# Altium project Power_Management_System.PrjPCB
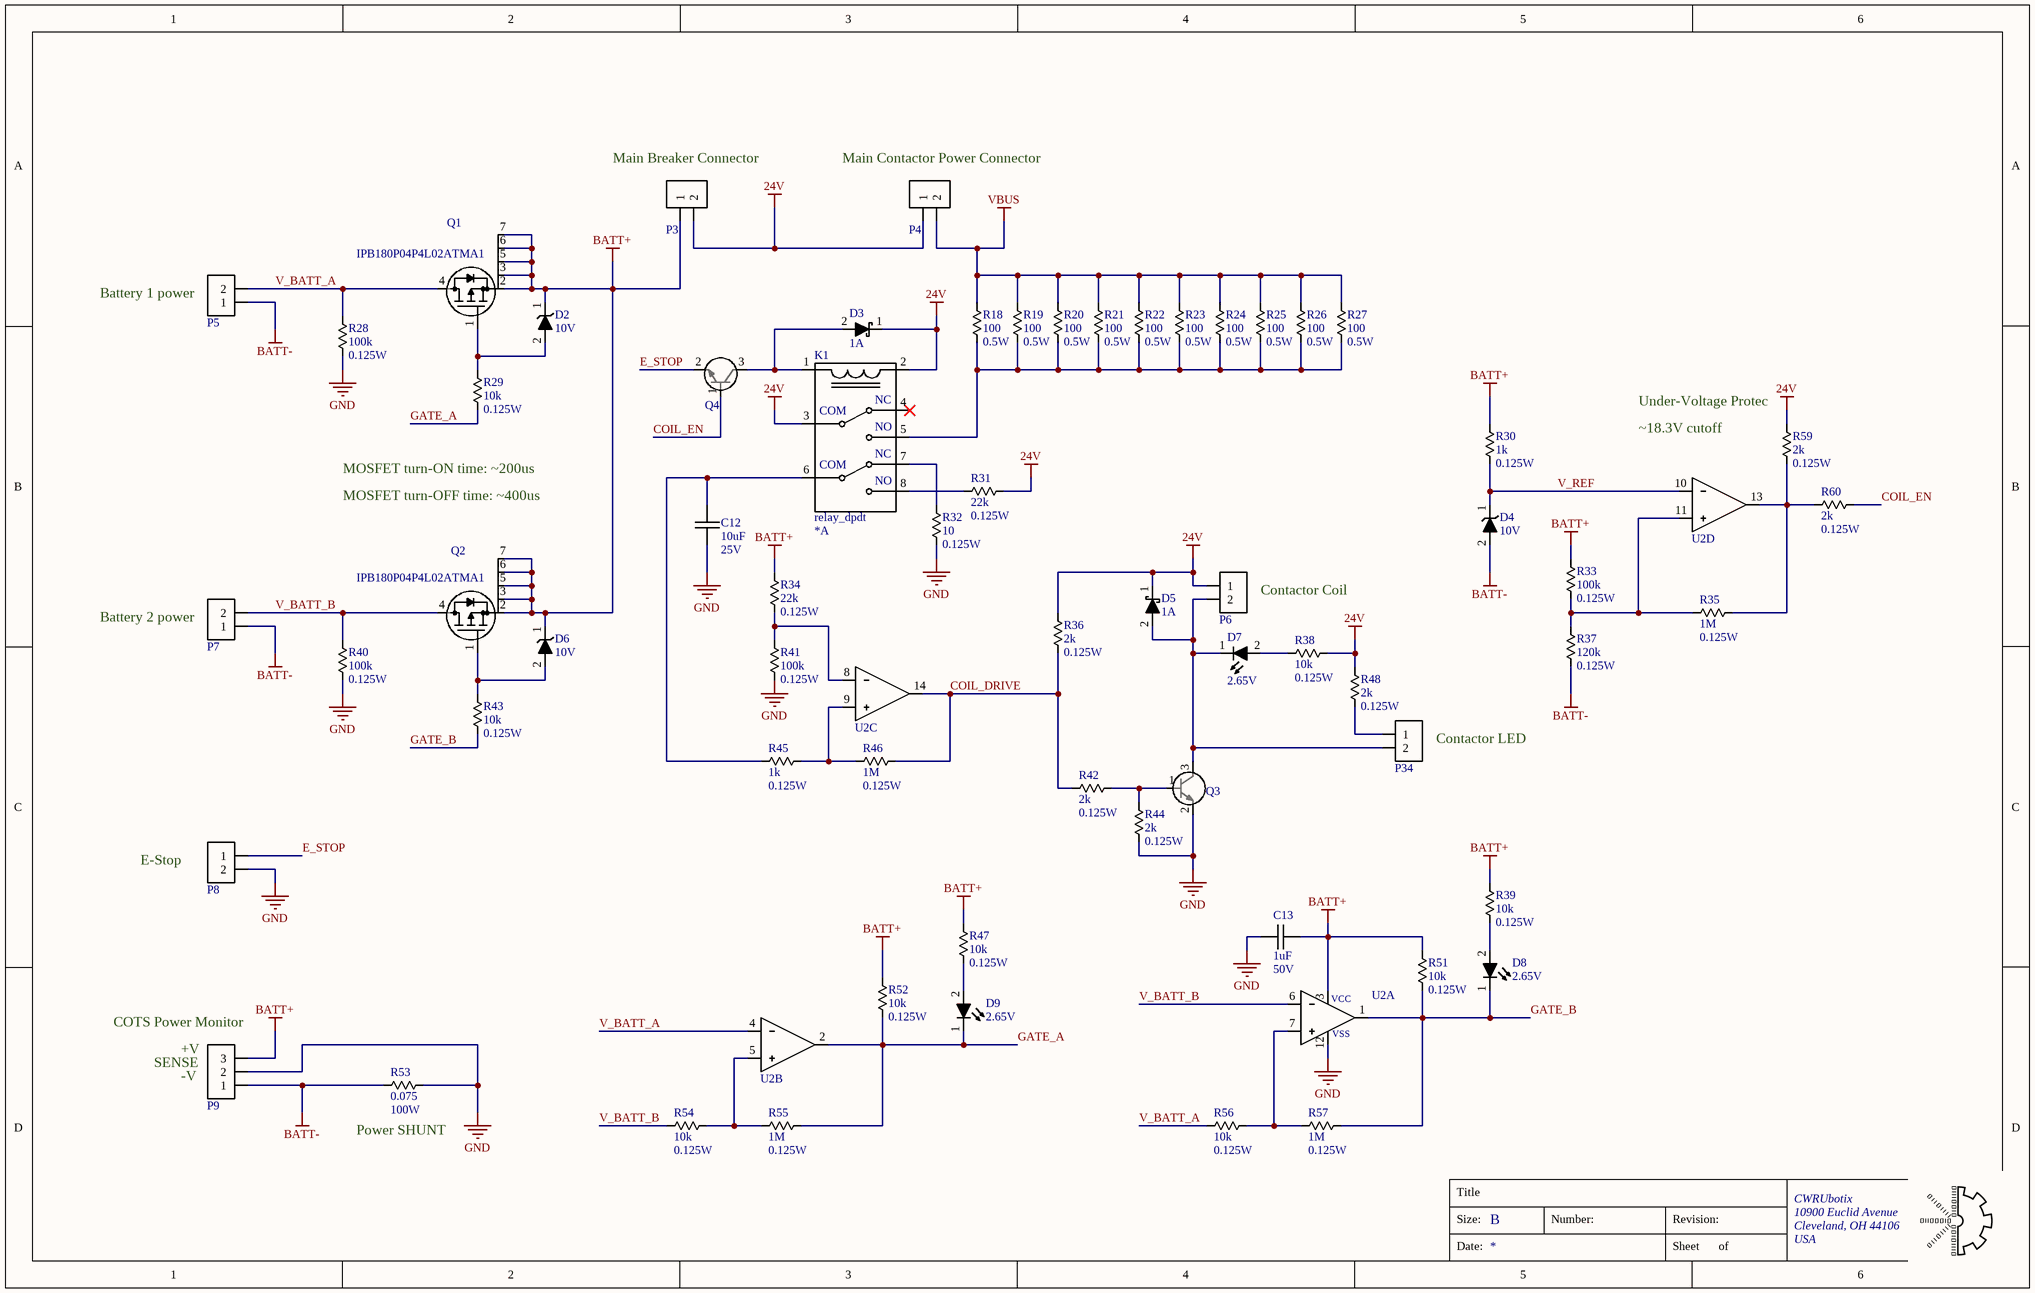
[diagram p0: power_input_SCH1.SchDoc]
3 sheets, 128 parts. Net scope: global (net labels, ports and power ports of the same name join across sheets).
Board file: PMS_board.PcbDoc
Sheets:
  power_input_SCH1.SchDoc
  battery_manager_SCH2.SchDoc
  power_output_SCH3.SchDoc

## Sheet power_input_SCH1.SchDoc
size B; Organization: CWRUbotix; Address1: 10900 Euclid Avenue; Address2: Cleveland, OH 44106; Address3: USA

### Parts
C12  Capacitance: 10uF  Voltage Rating: 25V  [chip_1206]  (hidden comment: cap_single_np)
C13  Capacitance: 1uF  Voltage Rating: 50V  [chip_0805]  (hidden comment: cap_single_np)
D2  Reverse Breakdown Voltage: 10V  [sod323_0]  (hidden comment: diode_1)
D3  Current Rating: 1A  [sod123_0]  (hidden comment: diode_2)
D4  Reverse Breakdown Voltage: 10V  [sod323_0]  (hidden comment: diode_1)
D5  Current Rating: 1A  [sod123_0]  (hidden comment: diode_2)
D6  Reverse Breakdown Voltage: 10V  [sod323_0]  (hidden comment: diode_1)
D7  Forward Voltage: 2.65V  [chip_0603]  (hidden comment: diode_4)
D8  Forward Voltage: 2.65V  [chip_0603]  (hidden comment: diode_4)
D9  Forward Voltage: 2.65V  [chip_0603]  (hidden comment: diode_4)
K1  relay_dpdt  Contact Current Rating: *A  [RELAY_SHRACK_RT2]
P3  conn-2x1_0  [BARR_0.5IN_2x1_0]  (value not drawn)
P4  conn-2x1_0  [BARR_0.5IN_2x1_0]  (value not drawn)
P5  conn-2x1_0  [BARR_0.5IN_2x1_0]  (value not drawn)
P6  conn-2x1_0  [JST_PHR_2_0]  (value not drawn)
P7  conn-2x1_0  [BARR_0.5IN_2x1_0]  (value not drawn)
P8  conn-2x1_0  [JST_PHR_2_0]  (value not drawn)
P9  conn-3x1_0  [JST_PHR_3_0]  (value not drawn)
P34  conn-2x1_0  [JST_PHR_2_0]  (value not drawn)
Q1  Manufacturer PN: IPB180P04P4L02ATMA1  [PG-TO263-7-3]  (hidden comment: p-mosfet_4)
Q2  Manufacturer PN: IPB180P04P4L02ATMA1  [PG-TO263-7-3]  (hidden comment: p-mosfet_4)
Q3  npn-bjt_0  [sot-23-3]  (value not drawn)
Q4  npn-bjt_0  [sot-23-3]  (value not drawn)
R18  Resistance: 100  Power Rating: 0.5W  [chip_1206]  (hidden comment: res_single)
R19  Resistance: 100  Power Rating: 0.5W  [chip_1206]  (hidden comment: res_single)
R20  Resistance: 100  Power Rating: 0.5W  [chip_1206]  (hidden comment: res_single)
R21  Resistance: 100  Power Rating: 0.5W  [chip_1206]  (hidden comment: res_single)
R22  Resistance: 100  Power Rating: 0.5W  [chip_1206]  (hidden comment: res_single)
R23  Resistance: 100  Power Rating: 0.5W  [chip_1206]  (hidden comment: res_single)
R24  Resistance: 100  Power Rating: 0.5W  [chip_1206]  (hidden comment: res_single)
R25  Resistance: 100  Power Rating: 0.5W  [chip_1206]  (hidden comment: res_single)
R26  Resistance: 100  Power Rating: 0.5W  [chip_1206]  (hidden comment: res_single)
R27  Resistance: 100  Power Rating: 0.5W  [chip_1206]  (hidden comment: res_single)
R28  Resistance: 100k  Power Rating: 0.125W  [chip_0805]  (hidden comment: res_single)
R29  Resistance: 10k  Power Rating: 0.125W  [chip_0805]  (hidden comment: res_single)
R30  Resistance: 1k  Power Rating: 0.125W  [chip_0805]  (hidden comment: res_single)
R31  Resistance: 22k  Power Rating: 0.125W  [chip_0805]  (hidden comment: res_single)
R32  Resistance: 10  Power Rating: 0.125W  [chip_0805]  (hidden comment: res_single)
R33  Resistance: 100k  Power Rating: 0.125W  [chip_0805]  (hidden comment: res_single)
R34  Resistance: 22k  Power Rating: 0.125W  [chip_0805]  (hidden comment: res_single)
R35  Resistance: 1M  Power Rating: 0.125W  [chip_0805]  (hidden comment: res_single)
R36  Resistance: 2k  Power Rating: 0.125W  [chip_0805]  (hidden comment: res_single)
R37  Resistance: 120k  Power Rating: 0.125W  [chip_0805]  (hidden comment: res_single)
R38  Resistance: 10k  Power Rating: 0.125W  [chip_0805]  (hidden comment: res_single)
R39  Resistance: 10k  Power Rating: 0.125W  [chip_0805]  (hidden comment: res_single)
R40  Resistance: 100k  Power Rating: 0.125W  [chip_0805]  (hidden comment: res_single)
R41  Resistance: 100k  Power Rating: 0.125W  [chip_0805]  (hidden comment: res_single)
R42  Resistance: 2k  Power Rating: 0.125W  [chip_0805]  (hidden comment: res_single)
R43  Resistance: 10k  Power Rating: 0.125W  [chip_0805]  (hidden comment: res_single)
R44  Resistance: 2k  Power Rating: 0.125W  [chip_0805]  (hidden comment: res_single)
R45  Resistance: 1k  Power Rating: 0.125W  [chip_0805]  (hidden comment: res_single)
R46  Resistance: 1M  Power Rating: 0.125W  [chip_0805]  (hidden comment: res_single)
R47  Resistance: 10k  Power Rating: 0.125W  [chip_0805]  (hidden comment: res_single)
R48  Resistance: 2k  Power Rating: 0.125W  [chip_0805]  (hidden comment: res_single)
R51  Resistance: 10k  Power Rating: 0.125W  [chip_0805]  (hidden comment: res_single)
R52  Resistance: 10k  Power Rating: 0.125W  [chip_0805]  (hidden comment: res_single)
R53  Resistance: 0.075  Power Rating: 100W  [TO-247-2-H]  (hidden comment: res_single)
R54  Resistance: 10k  Power Rating: 0.125W  [chip_0805]  (hidden comment: res_single)
R55  Resistance: 1M  Power Rating: 0.125W  [chip_0805]  (hidden comment: res_single)
R56  Resistance: 10k  Power Rating: 0.125W  [chip_0805]  (hidden comment: res_single)
R57  Resistance: 1M  Power Rating: 0.125W  [chip_0805]  (hidden comment: res_single)
R59  Resistance: 2k  Power Rating: 0.125W  [chip_0805]  (hidden comment: res_single)
R60  Resistance: 2k  Power Rating: 0.125W  [chip_0805]  (hidden comment: res_single)
U2  LM339  [so-14]  (value not drawn)  (parts A,B,C,D of 4)

### Nets
24V: D3.1 D5.1 K1.2 K1.3(COM) P3.2 P4.1 P6.1 R31.2 R36.2 R38.2 R48.2 R59.2
BATT+: C13.2 D2.1 D6.1 P3.1 P9.3 Q1.2(S) Q1.3(S) Q1.5(S) Q1.6(S) Q1.7(S) Q2.2(S) Q2.3(S) Q2.5(S) Q2.6(S) Q2.7(S) R30.2 R33.1 R34.1 R39.1 R47.2 R51.1 R52.1 U2.3
BATT-: D4.2 P5.1 P7.1 P9.1 R37.2 R53.1
GND: C12.2 C13.1 P8.2 P9.2 Q3.2(E) R28.1 R32.2 R40.2 R41.2 R44.2 R53.2 U2.12
VBUS: P4.2 R18.2 R19.2 R20.2 R21.2 R22.2 R23.2 R24.2 R25.2 R26.2 R27.2
COIL_DRIVE: R36.1 R42.1 R46.2 U2.14
COIL_EN: Q4.1(B) R60.1
E_STOP: P8.1 Q4.2(E)
GATE_A: D9.1 R29.2 R52.2 R55.2 U2.2
GATE_B: D8.1 R43.2 R51.2 R57.2 U2.1
V_BATT_A: P5.2 Q1.4(D) R28.2 R56.1 U2.4
V_BATT_B: P7.2 Q2.4(D) R40.1 R54.1 U2.6
V_REF: D4.1 R30.1 U2.10
NetC12_1: C12.1 K1.6(COM) R45.1
NetD2_2: D2.2 Q1.1(G) R29.1
NetD3_2: D3.2 K1.1 Q4.3(C)
NetD5_2: D5.2 D7.1 P6.2 P34.2 Q3.3(C)
NetD6_2: D6.2 Q2.1(G) R43.1
NetD7_2: D7.2 R38.1
NetD8_2: D8.2 R39.2
NetD9_2: D9.2 R47.1
NetK1_5: K1.5(NO) R18.1 R19.1 R20.1 R21.1 R22.1 R23.1 R24.1 R25.1 R26.1 R27.1
NetK1_7: K1.7(NC) R32.1
NetK1_8: K1.8(NO) R31.1
NetP34_1: P34.1 R48.1
NetQ3_1: Q3.1(B) R42.2 R44.1
NetR33_2: R33.2 R35.1 R37.1 U2.11
NetR34_2: R34.2 R41.1 U2.8
NetR35_2: R35.2 R59.1 R60.2 U2.13
NetR45_2: R45.2 R46.1 U2.9
NetR54_2: R54.2 R55.1 U2.5
NetR56_2: R56.2 R57.1 U2.7

Not connected (* = marked no-connect by the designer): K1 4(NC)*

### Notes on the sheet
- (near P3) Main Breaker Connector
- (near P4) Main Contactor Power Connector
- (near P5) Battery 1 power
- (near R59) Under-Voltage Protec
- ~18.3V cutoff
- MOSFET turn-ON time: ~200us
- MOSFET turn-OFF time: ~400us
- (near P7) Battery 2 power
- Contactor Coil
- (near P34) Contactor LED
- (near P8) E-Stop
- (near P9) COTS Power Monitor
- (near P9) SENSE
- (near P9) +V
- (near P9) -V
- (near R53) Power SHUNT
- Title
- Size:
- B
- Number:
- Revision:
- Date:
- Sheet
- of
- (in symbol ANLG-00006, part A) VCC; VSS

### Library data of the parts
C12 = CAP-00539: CAP, 10uF, ±10%, 25V, X7R, 1206; Manufacturer: Samsung; Manufacturer PN: CL31B106KAHNNNE; Tolerance: ±10%; Part Number: CAP-00539; Type: X7R
C13 = CAP-00109: CAP, 1uF, 10%, 50V, X7R, 0805; Manufacturer: Murata; Manufacturer PN: GRM21BR71H105KA12L; Tolerance: 10%; Part Number: CAP-00109; Type: X7R
D2 D4 D6 = DIO-00019: Dio Zen, 10V, 2%, 200mW, SOD-323; Manufacturer: ON Semi; Manufacturer PN: MM3Z10VST1G; Forward Voltage: 900mV; Type: Zener; Part Number: DIO-00019; Tolerance: 2%; Power Rating: 200mW
D3 D5 = DIO-00001: Dio Shtky, 1A, 0.55V, 40V, SOD-123; Manufacturer: ON Semi; Manufacturer PN: MBR140SFT1G; Forward Voltage: 550mV; Type: Schottky; Reverse Breakdown Voltage: 40V; Part Number: DIO-00001
D7-D9 = DIO-00050: LED, Green, 0603, Low current, HELI2 Series; Manufacturer: Kingbright; Manufacturer PN: APT1608LZGCK; Reverse Breakdown Voltage: 5V; Current Rating: 30mA; Power Rating: 120mW; Type: LED; Part Number: DIO-00050; Cost: 0.58
K1 = MISC-00005: Relay 24V, 8A, DPDT; Manufacturer: TE Connectivity; Manufacturer PN: RTE24024; Latching: *; Turn-on Voltage: *; Turn-off Voltage: *; Part Number: MISC-00005; Cost: 3.12; Weight: 13
P3-P5 P7 = CONN-00001: Barrier Blk, 2 Pos, 50 A; Manufacturer: Molex; Manufacturer PN: 389690002; Positions per level: 2; Levels: 1; Current: 50; Part Number: CONN-00001; Type: Barrier Block; Cost: 1.68; Weight: 7.5
P6 P8 P34 = CONN-00048: JST PH 2x1, THT, 2.00mm Pitch; Manufacturer PN: B2B-PH-K; Positions per level: 2; Levels: 1; Part Number: CONN-00048; Type: Header; Manufacturer: JST; Cost: 0.19
P9 = CONN-00047: JST PH 3x1, THT, 2.00mm Pitch; Manufacturer PN: B3B-PH-K; Positions per level: 3; Levels: 1; Part Number: CONN-00047; Type: Header; Manufacturer: JST; Cost: 0.19
Q1 Q2 = XSTR-00027: XSTR PFET, 180A, 40V, Vgs 1.7V, PG-TO263-7-3; Manufacturer: Infineon; Max Power: 150W; Max Current: 180A; Max Voltage: 40V; Type: PFET; Part Number: XSTR-00027; Vgs/Vce: 1.7V; Cost: 2.99
Q3 Q4 = XSTR-00021: XSTR NPN, 2A, 100V, Vce 0.15V, SOT-23; Manufacturer: ON Semi; Manufacturer PN: NSS1C201LT1G; Max Power: 490mW; Max Current: 2A; Max Voltage: 100V; Type: NPN; Part Number: XSTR-00021; Vgs/Vce: 0.15V; Cost: 0.48
R18-R27 = RES-00595: RES SMD 100 OHM 1% 1/2W 1206; Tolerance: 1%; Part Number: RES-00595
R28 R33 R40 R41 = RES-00302: RES SMD 100K OHM 1% 1/8W 0805; Manufacturer: Rohm Semiconductor; Manufacturer PN: KTR10EZPF1003; Tolerance: 1%; Part Number: RES-00302
R29 R38 R39 R43 R47 R51 R52 R54 R56 = RES-00307: RES SMD 10K OHM 1% 1/8W 0805; Manufacturer: Rohm Semiconductor; Manufacturer PN: KTR10EZPF1002; Tolerance: 1%; Part Number: RES-00307
R30 R45 = RES-00361: RES SMD 1K OHM 1% 1/8W 0805; Manufacturer: Rohm Semiconductor; Manufacturer PN: KTR10EZPF1001; Tolerance: 1%; Part Number: RES-00361
R31 R34 = RES-00391: RES SMD 22K OHM 1% 1/8W 0805; Manufacturer: Rohm Semiconductor; Manufacturer PN: KTR10EZPF2202; Tolerance: 1%; Part Number: RES-00391
R32 = RES-00117: RES SMD 10 OHM 1% 1/8W 0805; Manufacturer: Rohm Semiconductor; Manufacturer PN: KTR10EZPF10R0; Tolerance: 1%; Part Number: RES-00117
R35 R46 R55 R57 = RES-00363: RES SMD 1M OHM 1% 1/8W 0805; Manufacturer: Rohm Semiconductor; Manufacturer PN: KTR10EZPF1004; Tolerance: 1%; Part Number: RES-00363
R36 R42 R44 R48 R59 R60 = RES-00414: RES SMD 2K OHM 1% 1/8W 0805; Manufacturer: Rohm Semiconductor; Manufacturer PN: KTR10EZPF2001; Tolerance: 1%; Part Number: RES-00414
R37 = RES-00319: RES SMD 120K OHM 1% 1/8W 0805; Manufacturer: Rohm Semiconductor; Manufacturer PN: KTR10EZPF1203; Tolerance: 1%; Part Number: RES-00319
R53 = RES-00688: RES THT 0.075 OHM 1% 100W TO-247-2 Board Mounted; Manufacturer: Caddock; Manufacturer PN: MP9100-0.075-1%; Tolerance: 1%; Part Number: RES-00688
U2 = ANLG-00006: Comp, Quad, LM339; Manufacturer: TI; Part Number: ANLG-00006; Manufacturer PN: LM339

## Sheet battery_manager_SCH2.SchDoc
size B; Organization: CWRUbotix; Address1: 10900 Euclid Avenue; Address2: Cleveland, OH 44106; Address3: USA
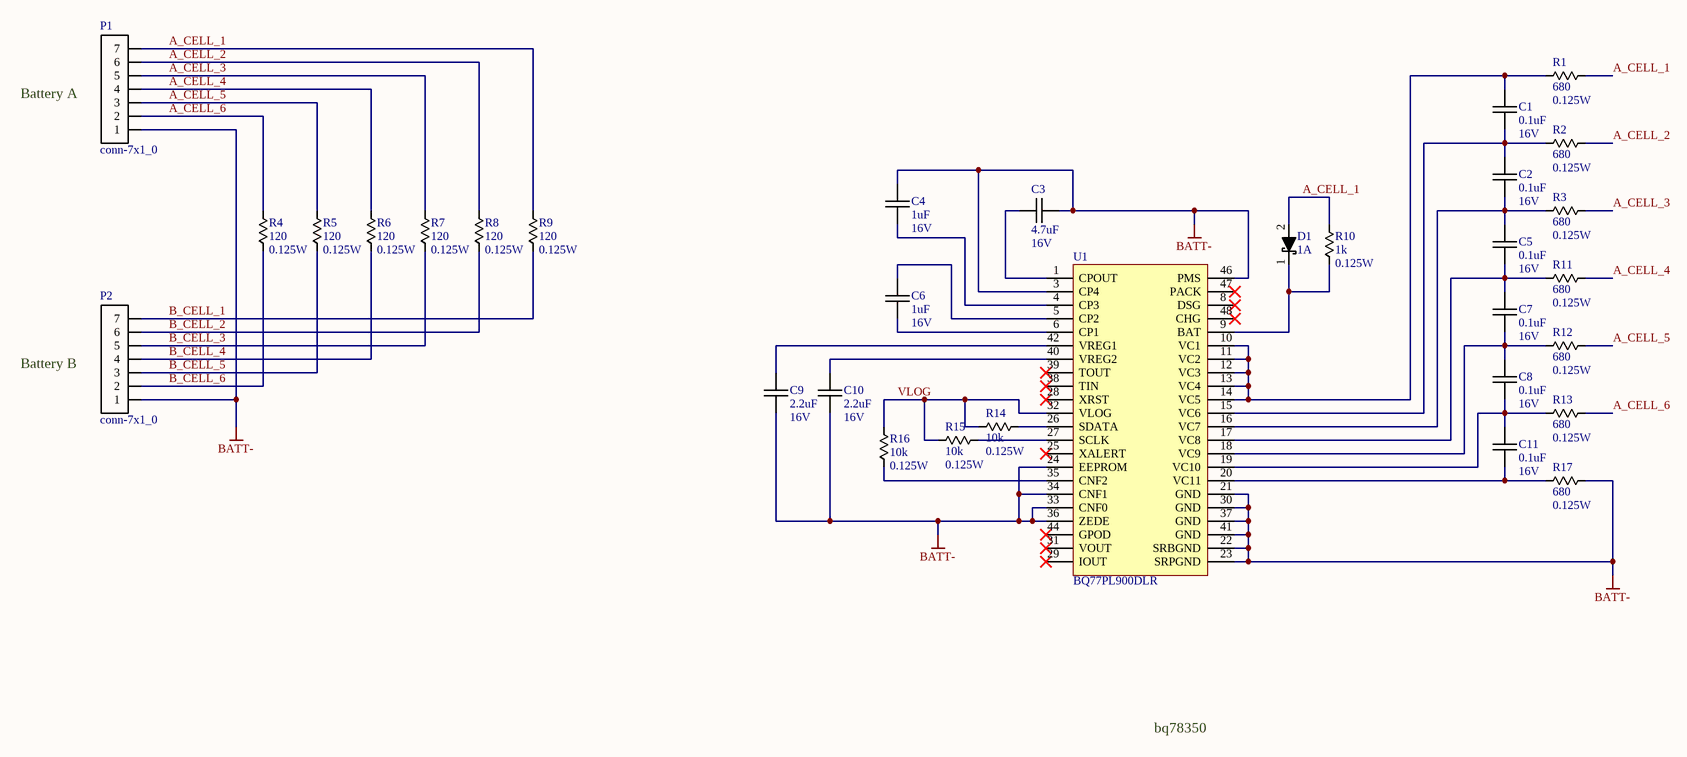
[diagram p1: battery_manager_SCH2.SchDoc]

### Parts
C1  Capacitance: 0.1uF  Voltage Rating: 16V  [chip_0603]  (hidden comment: cap_single_np)
C2  Capacitance: 0.1uF  Voltage Rating: 16V  [chip_0603]  (hidden comment: cap_single_np)
C3  Capacitance: 4.7uF  Voltage Rating: 16V  [chip_0805]  (hidden comment: cap_single_np)
C4  Capacitance: 1uF  Voltage Rating: 16V  [chip_0805]  (hidden comment: cap_single_np)
C5  Capacitance: 0.1uF  Voltage Rating: 16V  [chip_0603]  (hidden comment: cap_single_np)
C6  Capacitance: 1uF  Voltage Rating: 16V  [chip_0805]  (hidden comment: cap_single_np)
C7  Capacitance: 0.1uF  Voltage Rating: 16V  [chip_0603]  (hidden comment: cap_single_np)
C8  Capacitance: 0.1uF  Voltage Rating: 16V  [chip_0603]  (hidden comment: cap_single_np)
C9  Capacitance: 2.2uF  Voltage Rating: 16V  [chip_0805]  (hidden comment: cap_single_np)
C10  Capacitance: 2.2uF  Voltage Rating: 16V  [chip_0805]  (hidden comment: cap_single_np)
C11  Capacitance: 0.1uF  Voltage Rating: 16V  [chip_0603]  (hidden comment: cap_single_np)
D1  Current Rating: 1A  [sod123_0]  (hidden comment: diode_2)
P1  conn-7x1_0  [JST_XH_7_0]
P2  conn-7x1_0  [JST_XH_7_0]
R1  Resistance: 680  Power Rating: 0.125W  [chip_0805]  (hidden comment: res_single)
R2  Resistance: 680  Power Rating: 0.125W  [chip_0805]  (hidden comment: res_single)
R3  Resistance: 680  Power Rating: 0.125W  [chip_0805]  (hidden comment: res_single)
R4  Resistance: 120  Power Rating: 0.125W  [chip_0805]  (hidden comment: res_single)
R5  Resistance: 120  Power Rating: 0.125W  [chip_0805]  (hidden comment: res_single)
R6  Resistance: 120  Power Rating: 0.125W  [chip_0805]  (hidden comment: res_single)
R7  Resistance: 120  Power Rating: 0.125W  [chip_0805]  (hidden comment: res_single)
R8  Resistance: 120  Power Rating: 0.125W  [chip_0805]  (hidden comment: res_single)
R9  Resistance: 120  Power Rating: 0.125W  [chip_0805]  (hidden comment: res_single)
R10  Resistance: 1k  Power Rating: 0.125W  [chip_0805]  (hidden comment: res_single)
R11  Resistance: 680  Power Rating: 0.125W  [chip_0805]  (hidden comment: res_single)
R12  Resistance: 680  Power Rating: 0.125W  [chip_0805]  (hidden comment: res_single)
R13  Resistance: 680  Power Rating: 0.125W  [chip_0805]  (hidden comment: res_single)
R14  Resistance: 10k  Power Rating: 0.125W  [chip_0805]  (hidden comment: res_single)
R15  Resistance: 10k  Power Rating: 0.125W  [chip_0805]  (hidden comment: res_single)
R16  Resistance: 10k  Power Rating: 0.125W  [chip_0805]  (hidden comment: res_single)
R17  Resistance: 680  Power Rating: 0.125W  [chip_0805]  (hidden comment: res_single)
U1  Manufacturer PN: BQ77PL900DLR  [SSOP-48_0]  (hidden comment: BQ77PL900)

### Nets
BATT-: C3.2 C4.1 C9.2 C10.2 P1.1 P2.1 R17.2 U1.3(CP4) U1.21(GND) U1.22(SRBGND) U1.23(SRPGND) U1.24(EEPROM) U1.30(GND) U1.33(CNF0) U1.34(CNF1) U1.36(ZEDE) U1.37(GND) U1.41(GND) U1.46(PMS)
A_CELL_1: D1.2 P1.7 R1.2 R9.1 R10.2
A_CELL_2: P1.6 R2.2 R8.1
A_CELL_3: P1.5 R3.2 R7.1
A_CELL_4: P1.4 R6.1 R11.2
A_CELL_5: P1.3 R5.1 R12.2
A_CELL_6: P1.2 R4.1 R13.2
B_CELL_1: P2.7 R9.2
B_CELL_2: P2.6 R8.2
B_CELL_3: P2.5 R7.2
B_CELL_4: P2.4 R6.2
B_CELL_5: P2.3 R5.2
B_CELL_6: P2.2 R4.2
VLOG: R14.1 R15.1 R16.2 U1.32(VLOG)
NetC1_1: C1.1 R1.1 U1.10(VC1) U1.11(VC2) U1.12(VC3) U1.13(VC4) U1.14(VC5)
NetC1_2: C1.2 C2.1 R2.1 U1.15(VC6)
NetC2_2: C2.2 C5.1 R3.1 U1.16(VC7)
NetC3_1: C3.1 U1.1(CPOUT)
NetC4_2: C4.2 U1.4(CP3)
NetC5_2: C5.2 C7.1 R11.1 U1.17(VC8)
NetC6_1: C6.1 U1.5(CP2)
NetC6_2: C6.2 U1.6(CP1)
NetC7_2: C7.2 C8.1 R12.1 U1.18(VC9)
NetC8_2: C8.2 C11.1 R13.1 U1.19(VC10)
NetC9_1: C9.1 U1.42(VREG1)
NetC10_1: C10.1 U1.40(VREG2)
NetC11_2: C11.2 R17.1 U1.20(VC11)
NetD1_1: D1.1 R10.1 U1.9(BAT)
NetR14_2: R14.2 U1.26(SDATA)
NetR15_2: R15.2 U1.27(SCLK)
NetR16_1: R16.1 U1.35(CNF2)

Not connected (* = marked no-connect by the designer): U1 2(NC) 7(NC) 8(DSG)* 25(XALERT)* 28(XRST)* 29(IOUT)* 31(VOUT)* 38(TIN)* 39(TOUT)* 43(NC) 44(GPOD)* 45(NC) 47(PACK)* 48(CHG)*

### Notes on the sheet
- (near P1) Battery A
- (near P2) Battery B
- bq78350
- Title
- Size:
- B
- Number:
- Revision:
- Date:
- Sheet
- of

### Library data of the parts
C1 C2 C5 C7 C8 C11 = CAP-00542: CAP, 0.1uF, ±10%, 16V, X7R, 0603; Manufacturer: Murata; Tolerance: ±10%; Part Number: CAP-00542; Type: X7R
C3 = CAP-00127: CAP, 4.7uF, 10%, 16V, X7R, 0805; Manufacturer: Murata; Manufacturer PN: GRM21BR71C475KA73L; Tolerance: 10%; Part Number: CAP-00127; Type: X7R
C4 C6 = CAP-00107: CAP, 1uF, 10%, 16V, X7R, 0805; Manufacturer: Murata; Manufacturer PN: GRM21BR71C105KA01L; Tolerance: 10%; Part Number: CAP-00107; Type: X7R
C9 C10 = CAP-00117: CAP, 2.2uF, 10%, 16V, X7R, 0805; Manufacturer: Murata; Manufacturer PN: GRM21BR71C225KA12L; Tolerance: 10%; Part Number: CAP-00117; Type: X7R
D1 = DIO-00001: as D3 on sheet power_input_SCH1; Reverse Breakdown Voltage: 40V; Part Number: DIO-00001
P1 P2 = CONN-00036: JST XH 7x1, THT; Manufacturer PN: B7B-XH-A; Positions per level: 7; Levels: 1; Current: 3; Part Number: CONN-00036; Type: Thru-hole; Manufacturer: JST
R1-R3 R11-R13 R17 = RES-00250: RES SMD 680 OHM 1% 1/8W 0805; Manufacturer: Rohm Semiconductor; Manufacturer PN: KTR10EZPF6800; Tolerance: 1%; Part Number: RES-00250
R4-R9 = RES-00183: RES SMD 120 OHM 1% 1/8W 0805; Manufacturer: Rohm Semiconductor; Manufacturer PN: KTR10EZPF1200; Tolerance: 1%; Part Number: RES-00183
R10 = RES-00361: as R30 on sheet power_input_SCH1; Tolerance: 1%; Part Number: RES-00361
R14-R16 = RES-00307: as R29 on sheet power_input_SCH1; Tolerance: 1%; Part Number: RES-00307
U1 = PWREG-00024: Batt Manager, Li-Ion, 5-10 cells, bq77PL900; Manufacturer: TI; Voltage Range In: -0.3 - 60V; Reg Type: Batt Mngr; Fixed/Adj: Fixed; Part Number: PWREG-00024; Cost: 6.36

## Sheet power_output_SCH3.SchDoc
size B; Organization: CWRUbotix; Address1: 10900 Euclid Avenue; Address2: Cleveland, OH 44106; Address3: USA
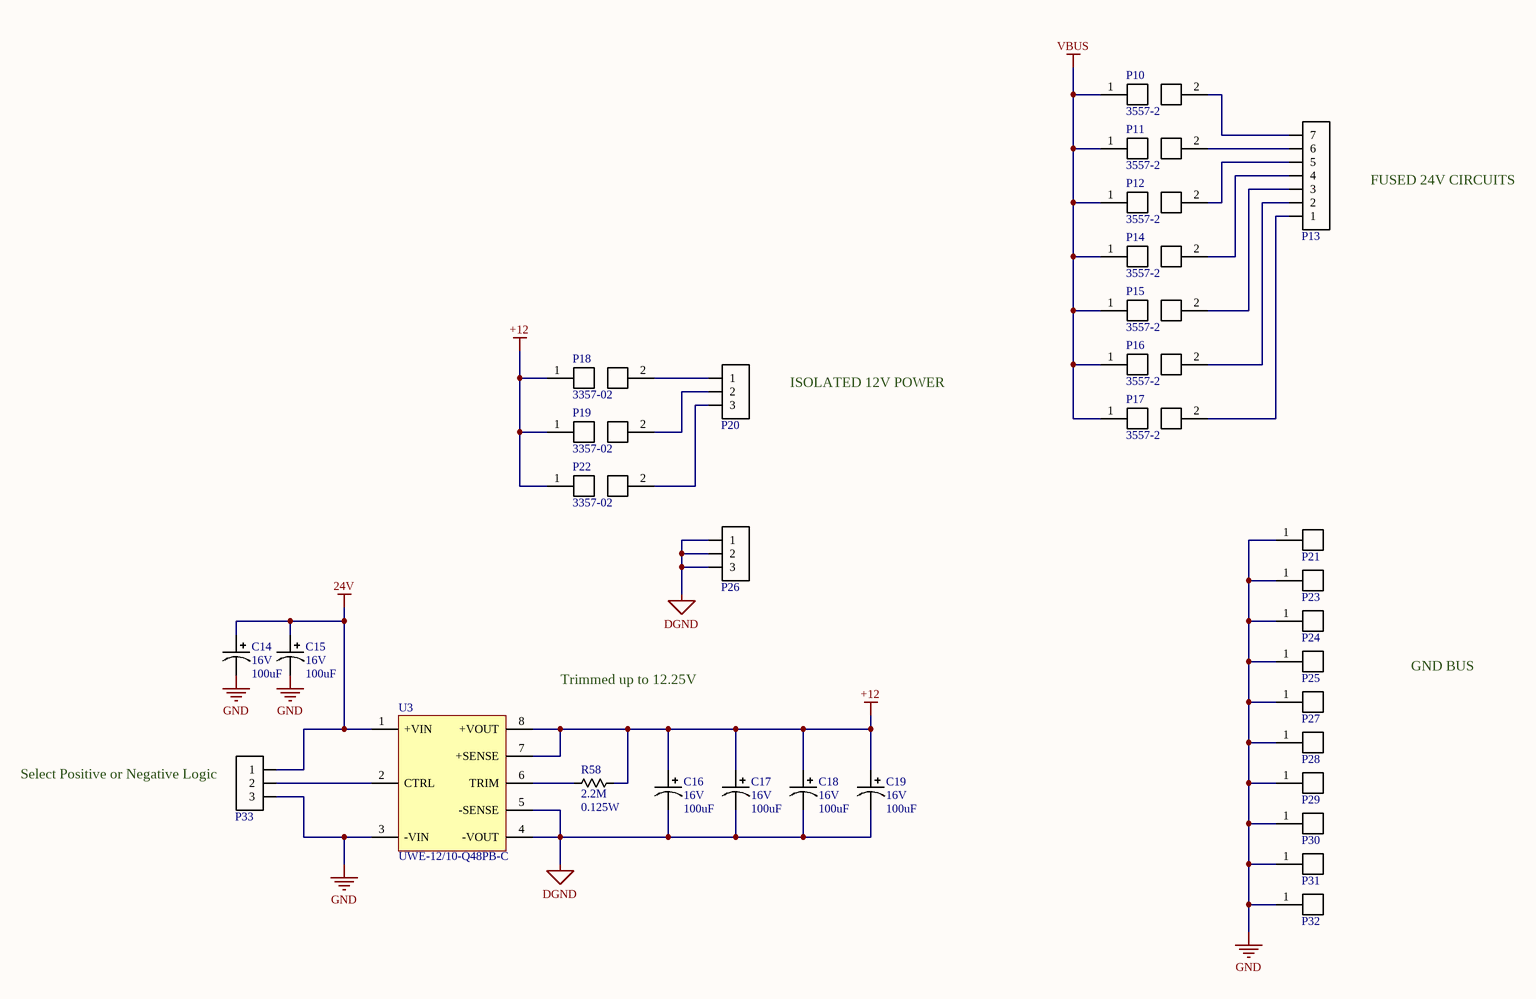
[diagram p2: power_output_SCH3.SchDoc]

### Parts
C14  Voltage Rating: 16V  Capacitance: 100uF  [chip_2917_AVX_TAJD]  (hidden comment: cap_single_p)
C15  Voltage Rating: 16V  Capacitance: 100uF  [chip_2917_AVX_TAJD]  (hidden comment: cap_single_p)
C16  Voltage Rating: 16V  Capacitance: 100uF  [chip_2917_AVX_TAJD]  (hidden comment: cap_single_p)
C17  Voltage Rating: 16V  Capacitance: 100uF  [chip_2917_AVX_TAJD]  (hidden comment: cap_single_p)
C18  Voltage Rating: 16V  Capacitance: 100uF  [chip_2917_AVX_TAJD]  (hidden comment: cap_single_p)
C19  Voltage Rating: 16V  Capacitance: 100uF  [chip_2917_AVX_TAJD]  (hidden comment: cap_single_p)
P10  Manufacturer PN: 3557-2  [FUSE_HOLDER_KEYSTONE_3557-2]  (hidden comment: conn-fuse-holder_0)
P11  Manufacturer PN: 3557-2  [FUSE_HOLDER_KEYSTONE_3557-2]  (hidden comment: conn-fuse-holder_0)
P12  Manufacturer PN: 3557-2  [FUSE_HOLDER_KEYSTONE_3557-2]  (hidden comment: conn-fuse-holder_0)
P13  conn-7x1_0  [MOLEX_387207507]  (value not drawn)
P14  Manufacturer PN: 3557-2  [FUSE_HOLDER_KEYSTONE_3557-2]  (hidden comment: conn-fuse-holder_0)
P15  Manufacturer PN: 3557-2  [FUSE_HOLDER_KEYSTONE_3557-2]  (hidden comment: conn-fuse-holder_0)
P16  Manufacturer PN: 3557-2  [FUSE_HOLDER_KEYSTONE_3557-2]  (hidden comment: conn-fuse-holder_0)
P17  Manufacturer PN: 3557-2  [FUSE_HOLDER_KEYSTONE_3557-2]  (hidden comment: conn-fuse-holder_0)
P18  Manufacturer PN: 3357-02  [FUSE_HOLDER_KEYSTONE_3557-2]  (hidden comment: conn-fuse-holder_0)
P19  Manufacturer PN: 3357-02  [FUSE_HOLDER_KEYSTONE_3557-2]  (hidden comment: conn-fuse-holder_0)
P20  conn-3x1_0  [PHOENIX_MKDS_5.08MM_3x1]  (value not drawn)
P21  conn-1x1_0  [KEYSTONE_7798]  (value not drawn)
P22  Manufacturer PN: 3357-02  [FUSE_HOLDER_KEYSTONE_3557-2]  (hidden comment: conn-fuse-holder_0)
P23  conn-1x1_0  [KEYSTONE_7798]  (value not drawn)
P24  conn-1x1_0  [KEYSTONE_7798]  (value not drawn)
P25  conn-1x1_0  [KEYSTONE_7798]  (value not drawn)
P26  conn-3x1_0  [PHOENIX_MKDS_5.08MM_3x1]  (value not drawn)
P27  conn-1x1_0  [KEYSTONE_7798]  (value not drawn)
P28  conn-1x1_0  [KEYSTONE_7798]  (value not drawn)
P29  conn-1x1_0  [KEYSTONE_7798]  (value not drawn)
P30  conn-1x1_0  [KEYSTONE_7798]  (value not drawn)
P31  conn-1x1_0  [KEYSTONE_7798]  (value not drawn)
P32  conn-1x1_0  [KEYSTONE_7798]  (value not drawn)
P33  conn-3x1_0  [hddr_3x1_0]  (value not drawn)
R58  Resistance: 2.2M  Power Rating: 0.125W  [chip_0805]  (hidden comment: res_single)
U3  Manufacturer PN: UWE-12/10-Q48PB-C  [EIGHTH_BRICK_6_0]  (hidden comment: eighth_brick_module_8)

### Nets
24V: C14.1 C15.1 P33.1 U3.1(+VIN)
+12: C16.1 C17.1 C18.1 C19.1 P18.1 P19.1 P22.1 R58.2 U3.7(+SENSE) U3.8(+VOUT)
DGND: C16.2 C17.2 C18.2 C19.2 P26.1 P26.2 P26.3 U3.4(-VOUT) U3.5(-SENSE)
GND: C14.2 C15.2 P21.1(P) P23.1(P) P24.1(P) P25.1(P) P27.1(P) P28.1(P) P29.1(P) P30.1(P) P31.1(P) P32.1(P) P33.3 U3.3(-VIN)
VBUS: P10.1 P11.1 P12.1 P14.1 P15.1 P16.1 P17.1
NetP10_2: P10.2 P13.7
NetP11_2: P11.2 P13.6
NetP12_2: P12.2 P13.5
NetP13_1: P13.1 P17.2
NetP13_2: P13.2 P16.2
NetP13_3: P13.3 P15.2
NetP13_4: P13.4 P14.2
NetP18_2: P18.2 P20.1
NetP19_2: P19.2 P20.2
NetP20_3: P20.3 P22.2
NetP33_2: P33.2 U3.2(CTRL)
NetR58_1: R58.1 U3.6(TRIM)

### Notes on the sheet
- FUSED 24V CIRCUITS
- ISOLATED 12V POWER
- Trimmed up to 12.25V
- GND BUS
- (near P33) Select Positive or Negative Logic
- Title
- Size:
- B
- Number:
- Revision:
- Date:
- Sheet
- of

### Library data of the parts
C14-C19 = CAP-00550: CAP, 100uF, ±10%, 16V, Tantalum, 2917; Manufacturer: AVX; Manufacturer PN: TAJD107K016RNJ; Tolerance: ±10%; Part Number: CAP-00550; Type: Tantalum; Cost: $0.94
P10-P12 P14-P19 P22 = CONN-00015: Fuse Holder, 30A, 500V, LP-Mini 897, ATOF 257; Manufacturer: Keystone Electronics; Current: 30; Positions per level: 2; Levels: 1; Part Number: CONN-00015
  P10-P12 P14-P17: Cost: 1.03
  P18 P19 P22: Cost: 0.98
P13 = CONN-00051: Barrier Blk, 7 Pos, 25A, 300V, 0.375" pitch; Manufacturer: Molex; Manufacturer PN: 387207507; Positions per level: 7; Levels: 1; Part Number: CONN-00051; Type: Barrier Block; Cost: 4.79
P20 P26 = CONN-00021: Term Blk, 3 Pos, 0.2", 10A, 14-30 AWG, Rising Cage Clamp; Manufacturer: Phoenix Contact; Manufacturer PN: 1729131; Positions per level: 3; Levels: 1; Current: 10; Part Number: CONN-00021; Type: Terminal Block; Cost: 0.79
P21 P23-P25 P27-P32 = CONN-00042: Screw Terminal, M4, 30A; Manufacturer PN: 7798; Manufacturer: Keystone; Positions per level: 1; Part Number: CONN-00042; Type: Screw Terminal; Levels: 1; Cost: 0.5; Weight: 3.27
P33 = CONN-00037: Header, 3x1, 0.1"; Positions per level: 3; Levels: 1; Part Number: CONN-00037; Type: Header
R58 = RES-00367: RES SMD 2.2M OHM 1% 1/8W 0805; Manufacturer: Rohm Semiconductor; Manufacturer PN: KTR10EZPF2204; Tolerance: 1%; Part Number: RES-00367
U3 = PWREG-00026: Module, Isolated, Eighth-Brick, 12V, 10A, Positive Logic; Manufacturer: Murata; Voltage Range In: 18 - 75V; Reg Type: Isolated Module; Fixed/Adj: Fixed; Part Number: PWREG-00026; Voltage Range Out: 12V; Max Current: 10A; Cost: 47; Weight: 20

## Nets that join several sheets
24V: power_input_SCH1 (12 pins), power_output_SCH3 (C14.1 C15.1 P33.1 U3.1)
BATT-: power_input_SCH1 (6 pins), battery_manager_SCH2 (19 pins)
GND: power_input_SCH1 (12 pins), power_output_SCH3 (14 pins)
VBUS: power_input_SCH1 (11 pins), power_output_SCH3 (7 pins)